# EAGLE design Winston-BOTTOM (EAGLE 9.5.1)
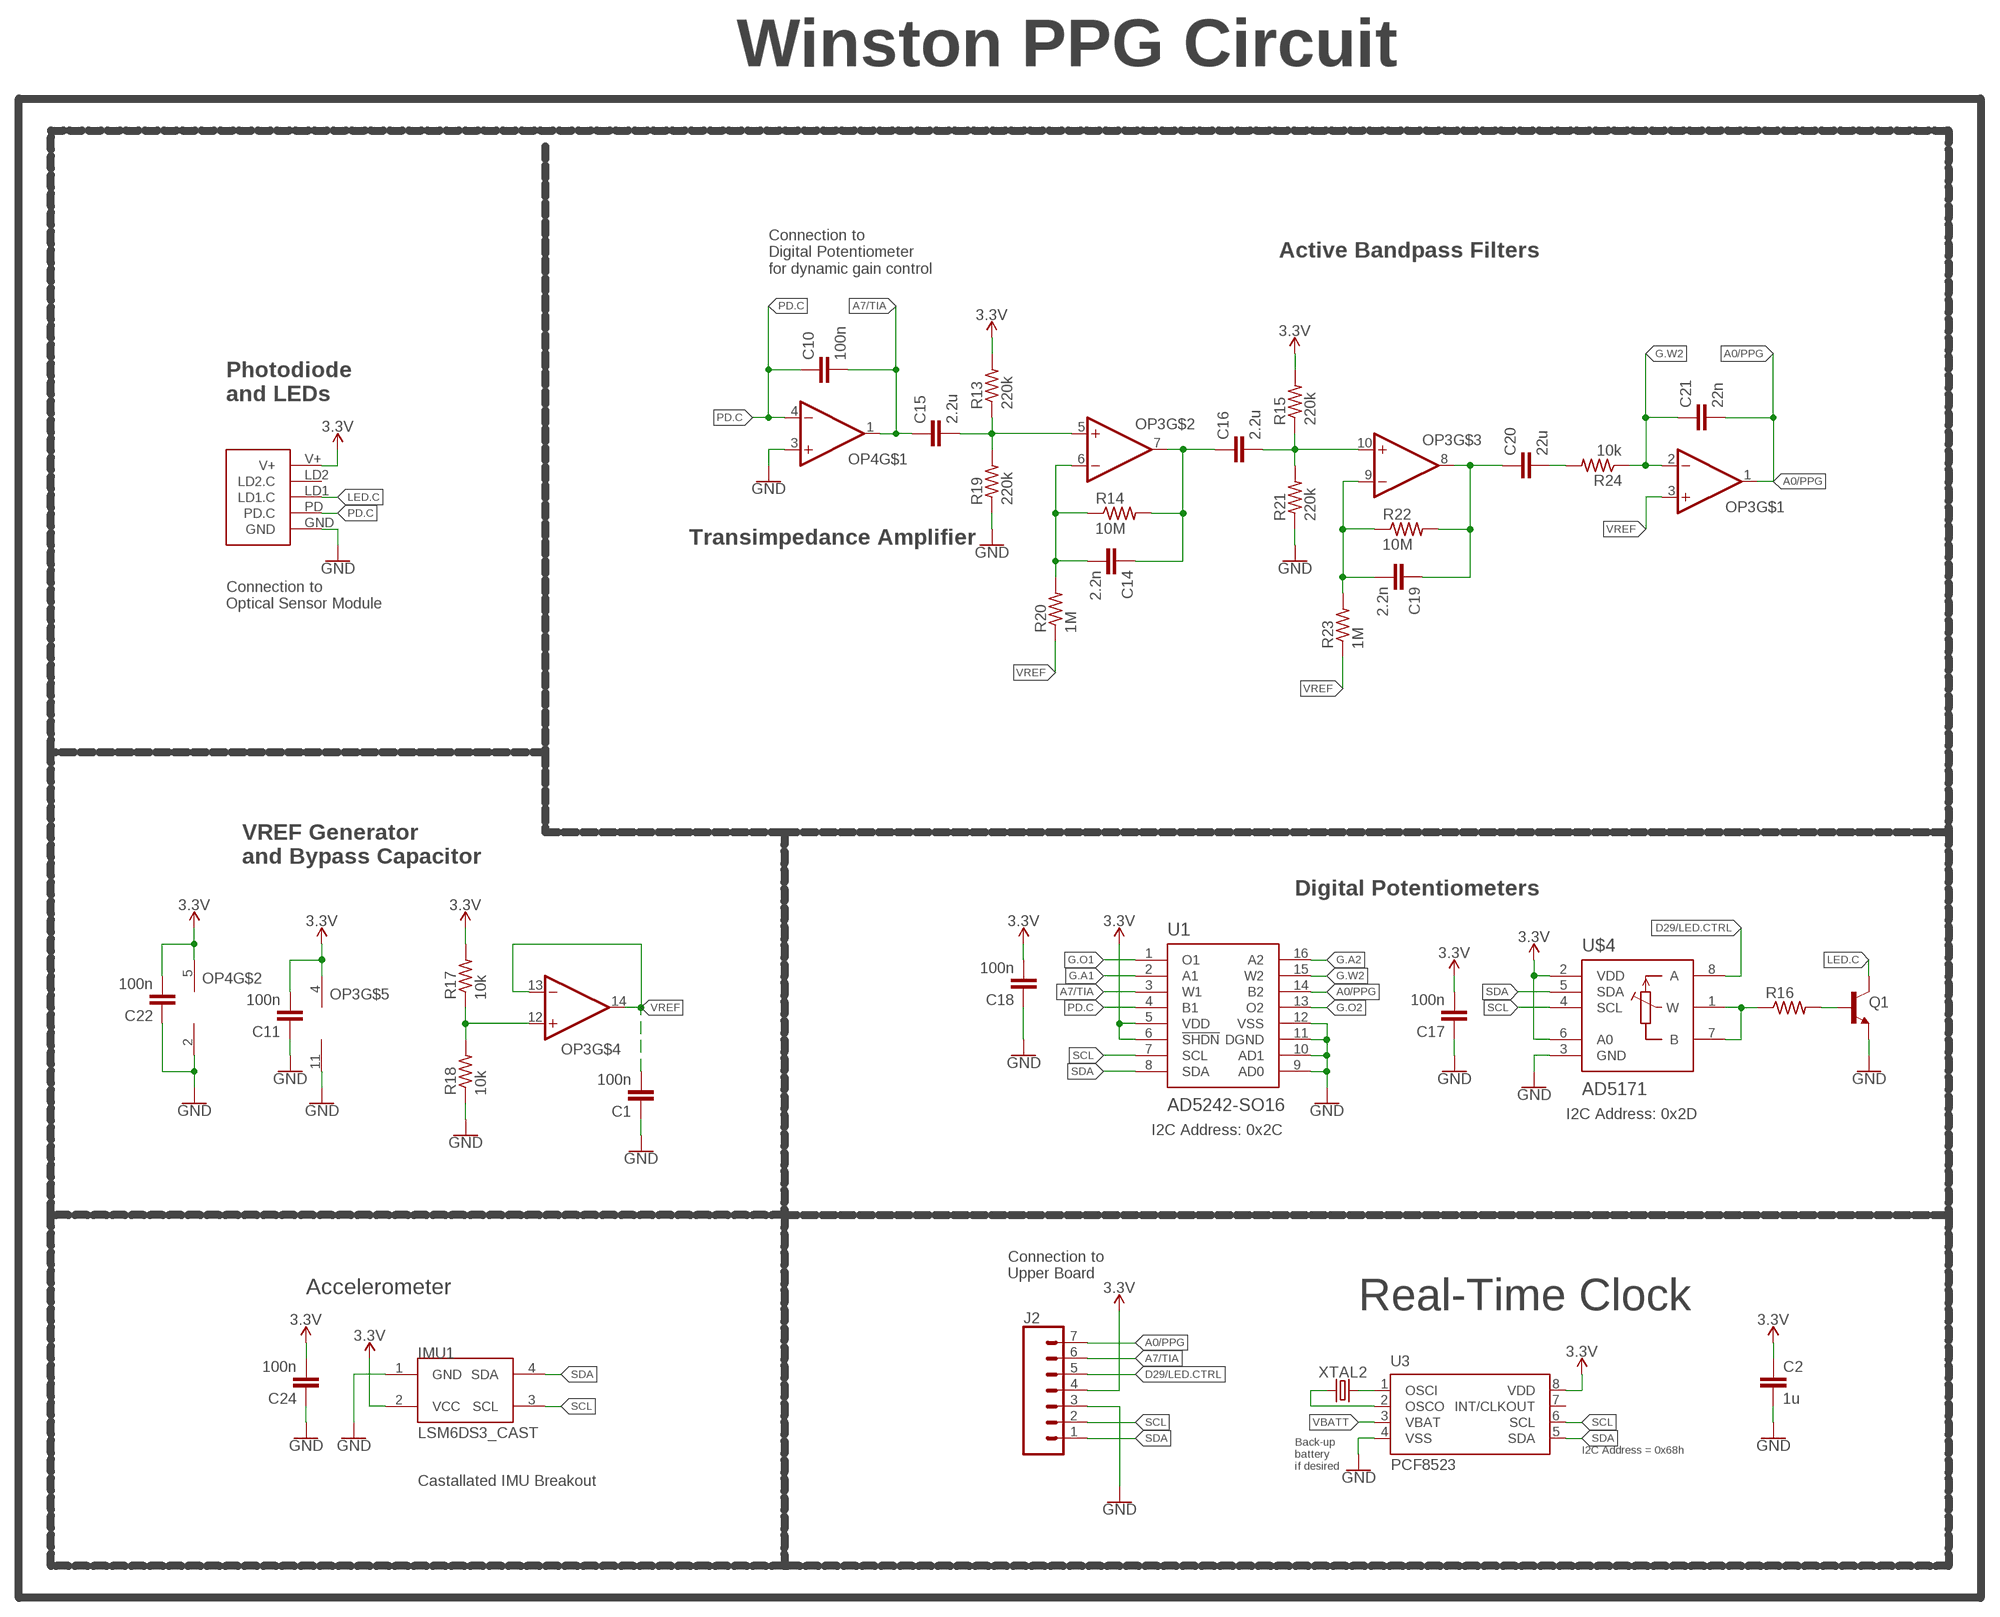
[diagram p0: schematic, sheet 1]

## Parts
C1  100n  CAPACITOR0603  [C0603]
C2  1u  CAPACITOR0603  [C0603]
C10  100n  CAPACITOR0603  [C0603]
C11  100n  CAPACITOR0603  [C0603]
C14  2.2n  CAPACITOR0603  [C0603]
C15  2.2u  CAPACITOR0603  [C0603]
C16  2.2u  CAPACITOR0603  [C0603]
C17  100n  CAPACITOR0603  [C0603]
C18  100n  CAPACITOR0603  [C0603]
C19  2.2n  CAPACITOR0603  [C0603]
C20  22u  CAPACITOR0603  [C0603]
C21  22n  CAPACITOR0603  [C0603]
C22  100n  CAPACITOR0603  [C0603]
C24  100n  CAPACITOR0603  [C0603]
IMU1  LSM6DS3_CAST  [LSM6DS3_CAST]
J2  CONN_07-1.27MM  [1X07_1.27MM]
OP3  OP-QUAD-SO14  [SO14]
OP4  OP-SINGLEOT  [SOT23-5]
Q1  NPN-GENERIC  [SOT23-3]
R13  220k  RESISTOR0603  [R0603]
R14  10M  RESISTOR0603  [R0603]
R15  220k  RESISTOR0603  [R0603]
R16  RESISTOR0603  [R0603]
R17  10k  RESISTOR0402  [R0402]
R18  10k  RESISTOR0402  [R0402]
R19  220k  RESISTOR0603  [R0603]
R20  1M  RESISTOR0603  [R0603]
R21  220k  RESISTOR0603  [R0603]
R22  10M  RESISTOR0603  [R0603]
R23  1M  RESISTOR0603  [R0603]
R24  10k  RESISTOR0603  [R0603]
U1  AD5242-SO16  [SO16]
U3  PCF8523  [SO8]
U$3  PPG.MODULE.2  [PPG.MODULE.2]
U$4  AD5171  [SOT-23-8]
XTAL2  32.7680kHz  CRYSTALECS-.327-12.5-12-C-TR  [2-SMD.NOLEAD.2.0MMTO1.2MM]

## Nets
3.3V: C2.1 C11.2 C17.2 C18.2 C22.2 C24.2 IMU1.2(VCC) J2.4 OP3.4(V+) OP4.5(V+) R13.2 R15.2 R17.2 U1.5(VDD) U1.6(!SHDN) U3.8(VDD) U$3.V+ U$4.2(VDD) U$4.6(A0)
A0/PPG: C21.2 J2.7 OP3.1(OUT) U1.14(B2)
A7/TIA: C10.2 C15.1 J2.6 OP4.1(OUT) U1.3(W1)
D29/LED.CTRL: J2.5 U$4.8(A)
G.A1: U1.2(A1)
G.A2: U1.16(A2)
G.O1: U1.1(O1)
G.O2: U1.13(O2)
G.W2: C21.1 OP3.2(-IN) R24.1 U1.15(W2)
GND: C1.1 C2.2 C11.1 C17.1 C18.1 C22.1 C24.1 IMU1.1(GND) J2.3 OP3.11(V-) OP4.2(V-) OP4.3(+IN) Q1.2(E) R18.1 R19.1 R21.1 U1.9(AD0) U1.10(AD1) U1.11(DGND) U1.12(VSS) U3.4(VSS) U$3.GND U$4.3(GND)
LED.C: Q1.3(C) U$3.LD1(LD1.C)
N$1: U3.2(OSCO) XTAL2.P$1
N$2: U3.1(OSCI) XTAL2.P$2
N$8: Q1.1(B) R16.2
N$9: R16.1 U$4.1(W) U$4.7(B)
N$10: OP3.12(+IN) R17.1 R18.2
N$13: C15.2 OP3.5(+IN) R13.1 R19.2
N$15: C14.2 OP3.6(-IN) R14.1 R20.2
N$16: C14.1 C16.1 OP3.7(OUT) R14.2
N$17: C16.2 OP3.10(+IN) R15.1 R21.2
N$18: C19.2 OP3.9(-IN) R22.1 R23.2
N$19: C19.1 C20.1 OP3.8(OUT) R22.2
N$20: C20.2 R24.2
PD.C: C10.1 OP4.4(-IN) U1.4(B1) U$3.PD(PD.C)
SCL: IMU1.3(SCL) J2.2 U1.7(SCL) U3.6(SCL) U$4.4(SCL)
SDA: IMU1.4(SDA) J2.1 U1.8(SDA) U3.5(SDA) U$4.5(SDA)
VBATT: U3.3(VBAT)
VREF: C1.2 OP3.3(+IN) OP3.13(-IN) OP3.14(OUT) R20.1 R23.1
Unconnected: U3.7(INT/CLKOUT) U$3.LD2(LD2.C)

## Notes on the sheet
- Winston PPG Circuit
- Active Bandpass Filters
- Connection to 
  Digital Potentiometer
  for dynamic gain control
- Photodiode
  and LEDs
- Transimpedance Amplifier
- Connection to 
  Optical Sensor Module
- VREF Generator
  and Bypass Capacitor
- Digital Potentiometers
- I2C Address: 0x2D
- I2C Address: 0x2C
- Connection to 
  Upper Board
- Accelerometer
- Real-Time Clock
- I2C Address = 0x68h
- Back-up
  battery
  if desired
- Castallated IMU Breakout

## Library data of the parts
C1 C2 C10 C11 C14-C22 C24 = LinnesLab-Passives:CAPACITOR
IMU1 = LinnesLab-Sensors:LSM6DS3_CAST
J2 = LinnesLab-Connectors:CONN_07: Multi connection point. Often used as Generic Header-pin footprint for 0.1 inch spaced/style header connections On any of the 0.1 inch spaced packages, you can populate with these: Break Away Headers - Straight <https://www.sparkfun.com/products/116> (PRT-00116) Break Away Male Headers - Right Angle <https://www.sparkfun.com/products/553> (PRT-00553) Female Headers <https://www.sparkfun.com/products/115> (PRT-00115) Break Away Headers - Machine Pin <https://www.sparkfun.com/products/117> (PRT-00117) Break Away Female Headers - Swiss Machine Pin <https://www.sparkfun.com/products/743> (PRT-00743) For SCREWTERMINALS and SPRING TERMINALS visit here: Screw Terimnals on SparkFun.com <https://www.sparkfun.com/search/results?term=Screw+Terminals> (5mm/3.5mm/2.54mm spacing) This device is also useful as a general connection point to wire up your design to another part of your project. Our various solder wires solder well into these plated through hole pads. Hook-Up Wire - Assortment (Stranded, 22 AWG) <https://www.sparkfun.com/products/11375> (PRT-11375) Hook-Up Wire - Assortment (Solid Core, 22 AWG) <https://www.sparkfun.com/products/11367> (PRT-11367) View the entire wire category on our website here <https://www.sparkfun.com/categories/141> Special notes: Molex polarized connector foot print use with SKU : PRT-08231 with associated crimp pins and housings. 1MM SMD Version SKU: PRT-10208 NOTES ON THE VARIANTS LOCK and LOCK_LONGPADS... This footprint was designed to help hold the alignment of a through-hole component (i.e. 6-pin header) while soldering it into place. You may notice that each hole has been shifted either up or down by 0.005 of an inch from it's more standard position (which is a perfectly straight line). This slight alteration caused the pins (the squares in the middle) to touch the edges of the holes. Because they are alternating, it causes a "brace" to hold the component in place. 0.005 has proven to be the perfect amount of "off-center" position when using our standard breakaway headers. Although looks a little odd when you look at the bare footprint, once you have a header in there, the alteration is very hard to notice. Also,if you push a header all the way into place, it is covered up entirely on the bottom side.
OP3 = LinnesLab-AnalogIC:OP-QUAD: General symbol and footprints for Quad Op Amps. Use with any standard general purpose op amp.
OP4 = LinnesLab-AnalogIC:OP-SINGLE: Single Op Amp 2.7V to 6.0V Single Supply CMOS Source: http://ww1.microchip.com/downloads/en/DeviceDoc/21314g.pdf
Q1 = LinnesLab-DiscreteSemi:NPN
R13-R24 = LinnesLab-Passives:RESISTOR
U1 = LinnesLab-DigitalIC:AD5242
U3 = LinnesLab-Clocks:PCF8523; DIGIKEY: 568-5306-1-ND; I2C_ADDRESS: 0x68h; MFN: PCF8523T/1,118; MFN_MANUFACTURER: NXP USA Inc.
U$3 = LinnesLab-Connectors:PPG.MODULE.2: Digi-Key Part Number: S9014E-50-ND Manufacturer Part Number: GRPB501VWVN-RC Description: 1mm insulation height 0.05in pitch 50 positions
U$4 = LinnesLab-DigitalIC:AD5171
XTAL2 = LinnesLab-Clocks:CRYSTAL; DIGIKEY: XC2288CT-ND; FREQ: 32.7680KHZ; LOAD_CAP: 12.5pF

## Board
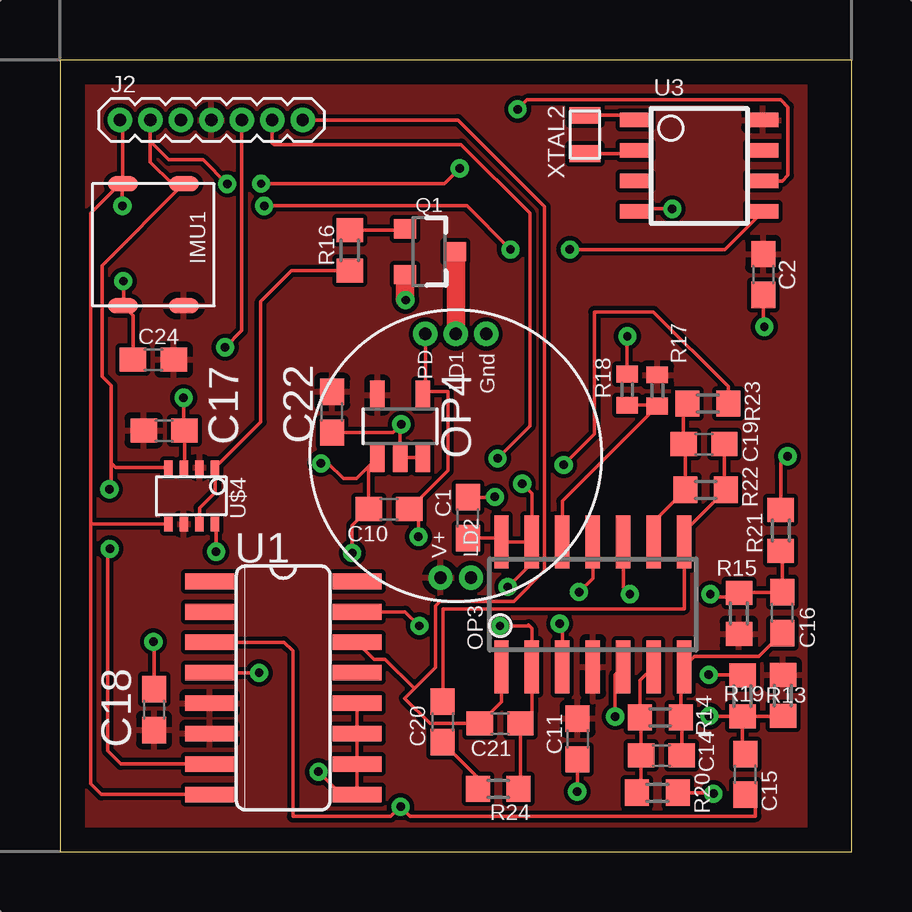
[diagram p1: board, top side]
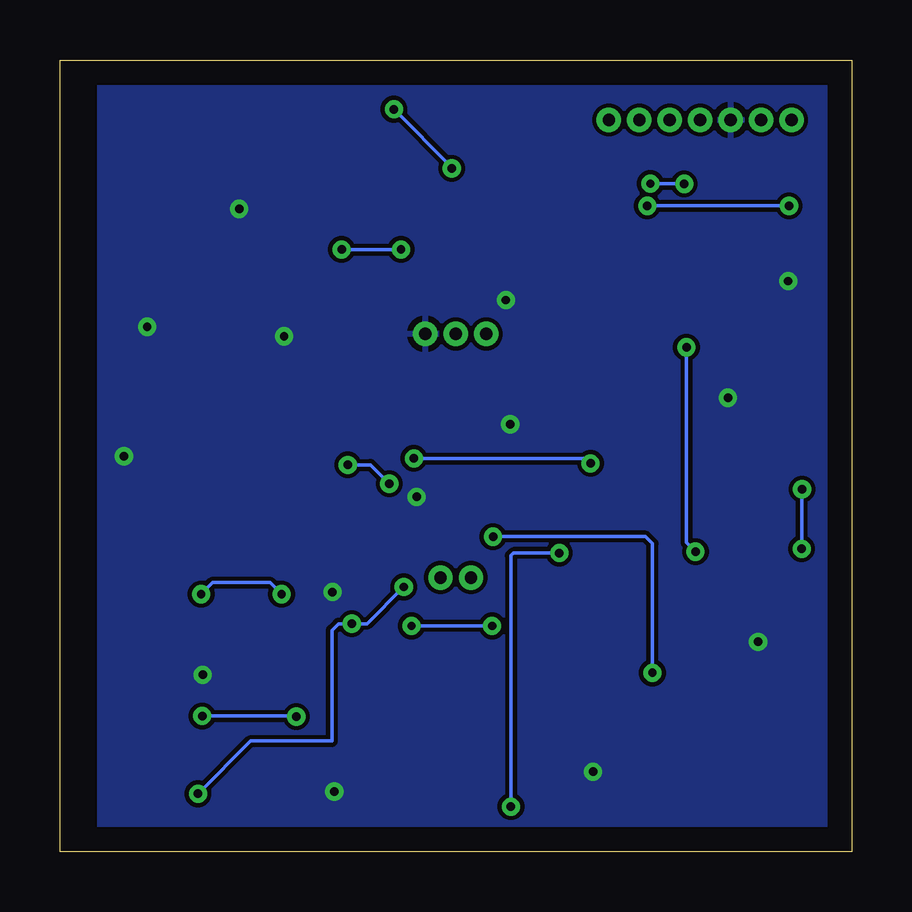
[diagram p2: board, bottom side, seen from below]

Size 33 x 33 mm. Coordinates in mm from the lower left corner, seen from the top.
Outline: 0,0 33,0 33,33 0,33 0,0
Copper layers (1*16): Top 0.035mm / dielectric 1.5mm / Bottom 0.035mm
Design rules "default": minimum track width 6mil, minimum drill 0.35mm, track to track 6mil, track to pad 6mil, pad to pad 6mil, via to via 6mil, smd to smd 6mil, copper to edge 40mil, drill to drill 6mil, minimum pad ring 10mil, minimum via ring 8mil, stop-mask expansion 4mil, vias tented up to drill 0mil, thermal gap 10mil

### Footprints (pad centres in the part's own frame; a part is rotated, then mirrored left to right if it is on the bottom)
C0603 = smd 1.1 x 1: 1 -0.85,0; 2 0.85,0
LSM6DS3_CAST = smd 0.635 x 1.27: 1 -2.54,1.27; 2 -2.54,-1.27; 3 2.54,-1.27; 4 2.54,1.27
1X07_1.27MM = drill 0.508 pad 1: 1 0,0; 2 1.27,0; 3 2.54,0; 4 3.81,0; 5 5.08,0; 6 6.35,0; 7 7.62,0
SO14 = smd 0.6 x 2.2: 1 -3.81,-2.6; 2 -2.54,-2.6; 3 -1.27,-2.6; 4 0,-2.6; 5 1.27,-2.6; 6 2.54,-2.6; 7 3.81,-2.6; 8 3.81,2.6; 9 2.54,2.6; 10 1.27,2.6; 11 0,2.6; 12 -1.27,2.6; 13 -2.54,2.6; 14 -3.81,2.6
SOT23-5 = smd 0.6 x 1.2: 1 -0.95,-1.306; 2 0,-1.306; 3 0.95,-1.306; 4 0.95,1.306; 5 -0.95,1.306
SOT23-3 = smd 0.8 x 0.9: 1 -0.95,-1; 2 0.95,-1; 3 0,1.1
R0603 = smd 1 x 1.1: 1 -0.85,0; 2 0.85,0
R0402 = smd 0.7 x 0.9: 1 -0.65,0; 2 0.65,0
SO16 = smd 0.66 x 2.032: 1 -4.445,-3.073; 2 -3.175,-3.073; 3 -1.905,-3.073; 4 -0.635,-3.073; 5 0.635,-3.073; 6 1.905,-3.073; 7 3.175,-3.073; 8 4.445,-3.073; 9 4.445,3.073; 10 3.175,3.073; 11 1.905,3.073; 12 0.635,3.073; 13 -0.635,3.073; 14 -1.905,3.073; 15 -3.175,3.073; 16 -4.445,3.073
SO8 = smd 1.3 x 0.6: 1 -2.65,1.905; 2 -2.65,0.635; 3 -2.65,-0.635; 4 -2.65,-1.905; 5 2.65,-1.905; 6 2.65,-0.635; 7 2.65,0.635; 8 2.65,1.905
PPG.MODULE.2 = drill 0.508 pad 0.94: GND 1.27,5.08; LD1 0,5.08; LD2 0.635,-5.08; PD -1.27,5.08; V+ -0.635,-5.08
SOT-23-8 = smd 0.35 x 0.6: 1 -0.991,-1.176; 2 -0.341,-1.176; 3 0.309,-1.176; 4 0.959,-1.176; 5 0.959,1.176; 6 0.309,1.176; 7 -0.341,1.176; 8 -0.991,1.176
2-SMD.NOLEAD.2.0MMTO1.2MM = smd 0.7 x 1.3: P$1 -0.8,0; P$2 0.8,0

### Placement (x,y rotation side)
C1  17,13.91 270 top
C2  29.32,24.06 270 top
C10  13.72,14.28 180 top
C11  21.58,4.69 90 top
C14  25.07,4.01 180 top
C15  28.57,3.22 90 top
C16  30.12,9.96 90 top
C17  4.35,17.55 180 top
C18  3.92,5.92 270 top
C19  26.85,16.99 180 top
C20  15.95,5.41 270 top
C21  18.35,5.34 180 top
C22  11.35,18.32 90 top
C24  3.9,20.5 0 top
IMU1  3.89,25.3 90 top
J2  2.5,30.5 0 top
OP3  22.21,10.3 0 top
OP4  14.18,17.73 0 top
Q1  15.39,25.01 270 top
R13  30.14,6.5 90 top
R14  25.03,5.59 0 top
R15  28.31,9.93 270 top
R16  12.08,25.06 90 top
R17  24.9,19.22 90 top
R18  23.64,19.26 270 top
R19  28.45,6.48 270 top
R20  24.9,2.45 180 top
R21  30.05,13.39 270 top
R22  26.91,15.08 0 top
R23  27.01,18.68 180 top
R24  18.27,2.62 180 top
U1  9.31,6.82 270 top
U3  26.65,28.59 0 top
U$3  16.5,16.5 0 top
U$4  5.47,14.83 180 top
XTAL2  21.88,29.89 90 top

### Tracks (layer width: path | path; a pad name or v marks a point on that pad's centre or on a via)
3.3V
  pour Top (isolate 0.178): 0.89,32.59 31.09,32.59 31.09,0.7 0.9,0.7
A0/PPG
  Top 0.152: OP3.1 18.4,6.24 C21.2 15.43,5.34 14.37,6.39 14.77,6.79 | U1.14 13.09,8.02 13.55,8.02 14.77,6.79 | J2.7 16.59,30.5 20.2,26.88 20.2,11.71 18.92,10.43 15.84,10.43 15.66,10.25 15.66,7.68 14.77,6.79
A7/TIA  (via drill 0.35)
  Top 0.152: v12.18,12.45 12.18,13.6 C10.2 12.87,16.06 OP4.1 12.36,15.55 11.81,15.55 11.18,16.18 v10.88,16.18 | C15.1 29,1.94 29,1.47 14.6,1.47 v14.2,1.87 13.79,1.46 9.71,1.46 9.71,8.36 9.34,8.73 U1.3 | J2.6 8.85,29.54 8.92,29.47 16.73,29.47 19.59,26.61 19.59,17.74 v18.24,16.39
  Bottom 0.152: v12.18,12.45 14.09,12.45 14.2,12.33 v14.2,1.87 | v18.24,16.39 11.09,16.39 v10.88,16.18
D29/LED.CTRL  (via drill 0.35)
  Top 0.152: J2.5 7.58,21.72 v6.88,21.02 | v6.5,12.5 6.5,13.61 U$4.8
  Bottom 0.152: v6.88,21.02 6.88,12.88 v6.5,12.5
G.W2  (via drill 0.35)
  Top 0.152: R24.1 19.2,2.69 C21.1 19.67,5.81 OP3.2 19.67,9.3 19.54,9.44 19.5,9.41 v18.35,9.41 | U1.15 14.39,10 v14.98,9.41
  Bottom 0.152: v14.98,9.41 v18.35,9.41
GND  (via drill 0.35)
  Top 0.152: R18.1 23.64,21.47 v23.65,21.48 | OP3.11 22.21,11.39 v21.64,10.82 | v30.34,16.48 30.05,16.19 R21.1 | v27.05,7.37 28.42,7.37 R19.1 | C11.1 21.58,2.52 v21.56,2.5 | C18.1 3.92,8.72 v3.9,8.74 | 14.18,17.76 OP4.2 OP4.3 | 14.18,17.76 v14.23,17.81 | 11.57,17.25 C22.1 13.88,17.47 14.18,17.76 | U1.12 U1.11 U1.10 U1.9 11.72,2.38 v10.77,3.33 | v2.64,23.78 2.65,23.77 2.65,22.79 IMU1.1 3.05,22.34 C24.1 | U$4.3 5.2,16.04 C17.1 5.15,17.6 v5.15,18.92 | C1.1 18.11,14.76 v18.13,14.79 | U3.4 24.11,26.79 v25.53,26.79 | C2.2 29.32,21.92 v29.36,21.87
  Top 0.762: Q1.2 14.39,23.01 v14.41,22.99
  pour Bottom (isolate 0.178): 31.38,32.48 31.38,0.91 0.74,0.91 0.74,32.49
LED.C
  Top 0.762: Q1.3 16.5,25 U$3.LD1
N$1
  Top 0.152: XTAL2.P$1 23.86,29.09 U3.2
N$2
  Top 0.152: XTAL2.P$2 23.8,30.69 U3.1
N$8
  Top 0.152: R16.2 14.34,25.91 Q1.1
N$9
  Top 0.152: R16.1 9.66,24.21 8.37,22.92 8.37,17.91 U$4.1 6.46,14.98 5.81,14.33 U$4.7
N$10
  Top 0.152: R18.2 24.87,18.61 R17.1 20.94,14.61 OP3.12
N$13  (via drill 0.35)
  Top 0.152: R19.2 28.45,4.19 C15.2 | R19.2 30.12,5.63 R13.1 | R19.2 27.09,5.63 v27.07,5.65 | v23.14,5.62 23.14,7.37 OP3.5
  Bottom 0.152: v27.07,5.65 23.17,5.65 v23.14,5.62
N$15
  Top 0.152: OP3.6 24.18,7.13 R14.1 24.22,5.55 C14.2 24.22,2.62 R20.2
N$16
  Top 0.152: C14.1 25.92,5.55 R14.2 25.88,7.56 OP3.7 26.45,8.13 29.14,8.13 C16.1
N$17  (via drill 0.35)
  Top 0.152: R21.2 30.12,12.47 C16.2 28.31,10.81 R15.1 28.15,10.62 27.23,10.62 v27.12,10.73 | v23.76,10.73 23.48,11.01 OP3.10
  Bottom 0.152: v27.12,10.73 26.63,11.22 24.25,11.22 v23.76,10.73
N$18
  Top 0.152: OP3.9 24.75,13.77 R22.1 26.06,16.93 C19.2 26,18.51 R23.2
N$19
  Top 0.152: C20.1 15.97,6.28 15.97,10.12 26.02,10.12 OP3.8 26.02,13.34 R22.2 27.7,15.14 C19.1
N$20
  Top 0.152: R24.2 17.43,3.08 C20.2
PD.C  (via drill 0.35)
  Top 0.152: U$3.PD 15.23,19.13 | 15.23,19.13 OP4.4 | 15.23,19.13 15.27,19.17 16.17,19.17 16.17,15.88 C10.1 14.95,13.91 v14.95,13.13 | U1.4 v8.29,7.46 v8.3,7.45
  Bottom 0.152: v8.3,7.45 8.3,12.84 8.59,13.13 v14.95,13.13
SCL  (via drill 0.35)
  Top 0.152: J2.2 3.77,30.47 3.77,29.61 | 3.77,29.61 3.77,28.74 4.67,27.84 IMU1.3 1.76,24.43 1.76,19.8 2.14,19.42 2.14,16.2 | U1.7 2.54,3.65 1.99,4.19 1.99,12.54 v2.08,12.62 | 2.14,16.2 2.14,15.18 v2.06,15.11 | U$4.4 2.33,16.01 2.14,16.2 | U3.6 30.11,27.95 30.35,28.19 30.35,31.04 30.05,31.34 19.47,31.34 v19.08,30.94 | v16.67,28.48 16.03,27.84 v8.39,27.84 | v6.97,27.83 5.96,28.84 4.54,28.84 3.77,29.61
  Bottom 0.152: v2.08,12.62 2.08,15.09 v2.06,15.11 | v19.08,30.94 16.67,28.53 v16.67,28.48 | v8.39,27.84 6.98,27.84 v6.97,27.83
SDA  (via drill 0.35)
  Top 0.152: J2.1 2.62,30.38 IMU1.4 | U1.8 1.73,2.38 1.29,2.82 1.29,13.64 | 1.29,13.64 1.29,26.62 2.5,27.84 IMU1.4 | U$4.5 1.31,13.65 1.29,13.64 | U3.5 27.71,25.1 v21.26,25.1 | v18.78,25.1 16.96,26.92 v8.52,26.92 | v2.6,26.92 2.6,27.82 IMU1.4
  Bottom 0.152: v21.26,25.1 v18.78,25.1 | v8.52,26.92 v2.6,26.92
VREF  (via drill 0.35)
  Top 0.152: OP3.13 OP3.14 18.25,13.06 C1.2 | OP3.13 19.67,12.04 v18.67,11.03 | v20.84,9.5 20.94,9.39 OP3.3 | v21,16.12 22.27,17.4 22.27,22.5 24.74,22.5 27.86,19.38 R23.1 | v19.27,15.33 19.67,14.92 OP3.13 | R20.1 27.2,2.45 v27.25,2.41
  Bottom 0.152: v18.67,11.03 20.2,9.5 v20.84,9.5 21.39,9.5 21.67,9.22 21.67,4.61 25.05,4.61 v27.25,2.41 | v21,16.12 20.06,16.12 v19.27,15.33